# EAGLE design OLIMEXINO-32U4_rev_A3 (EAGLE 6.4)
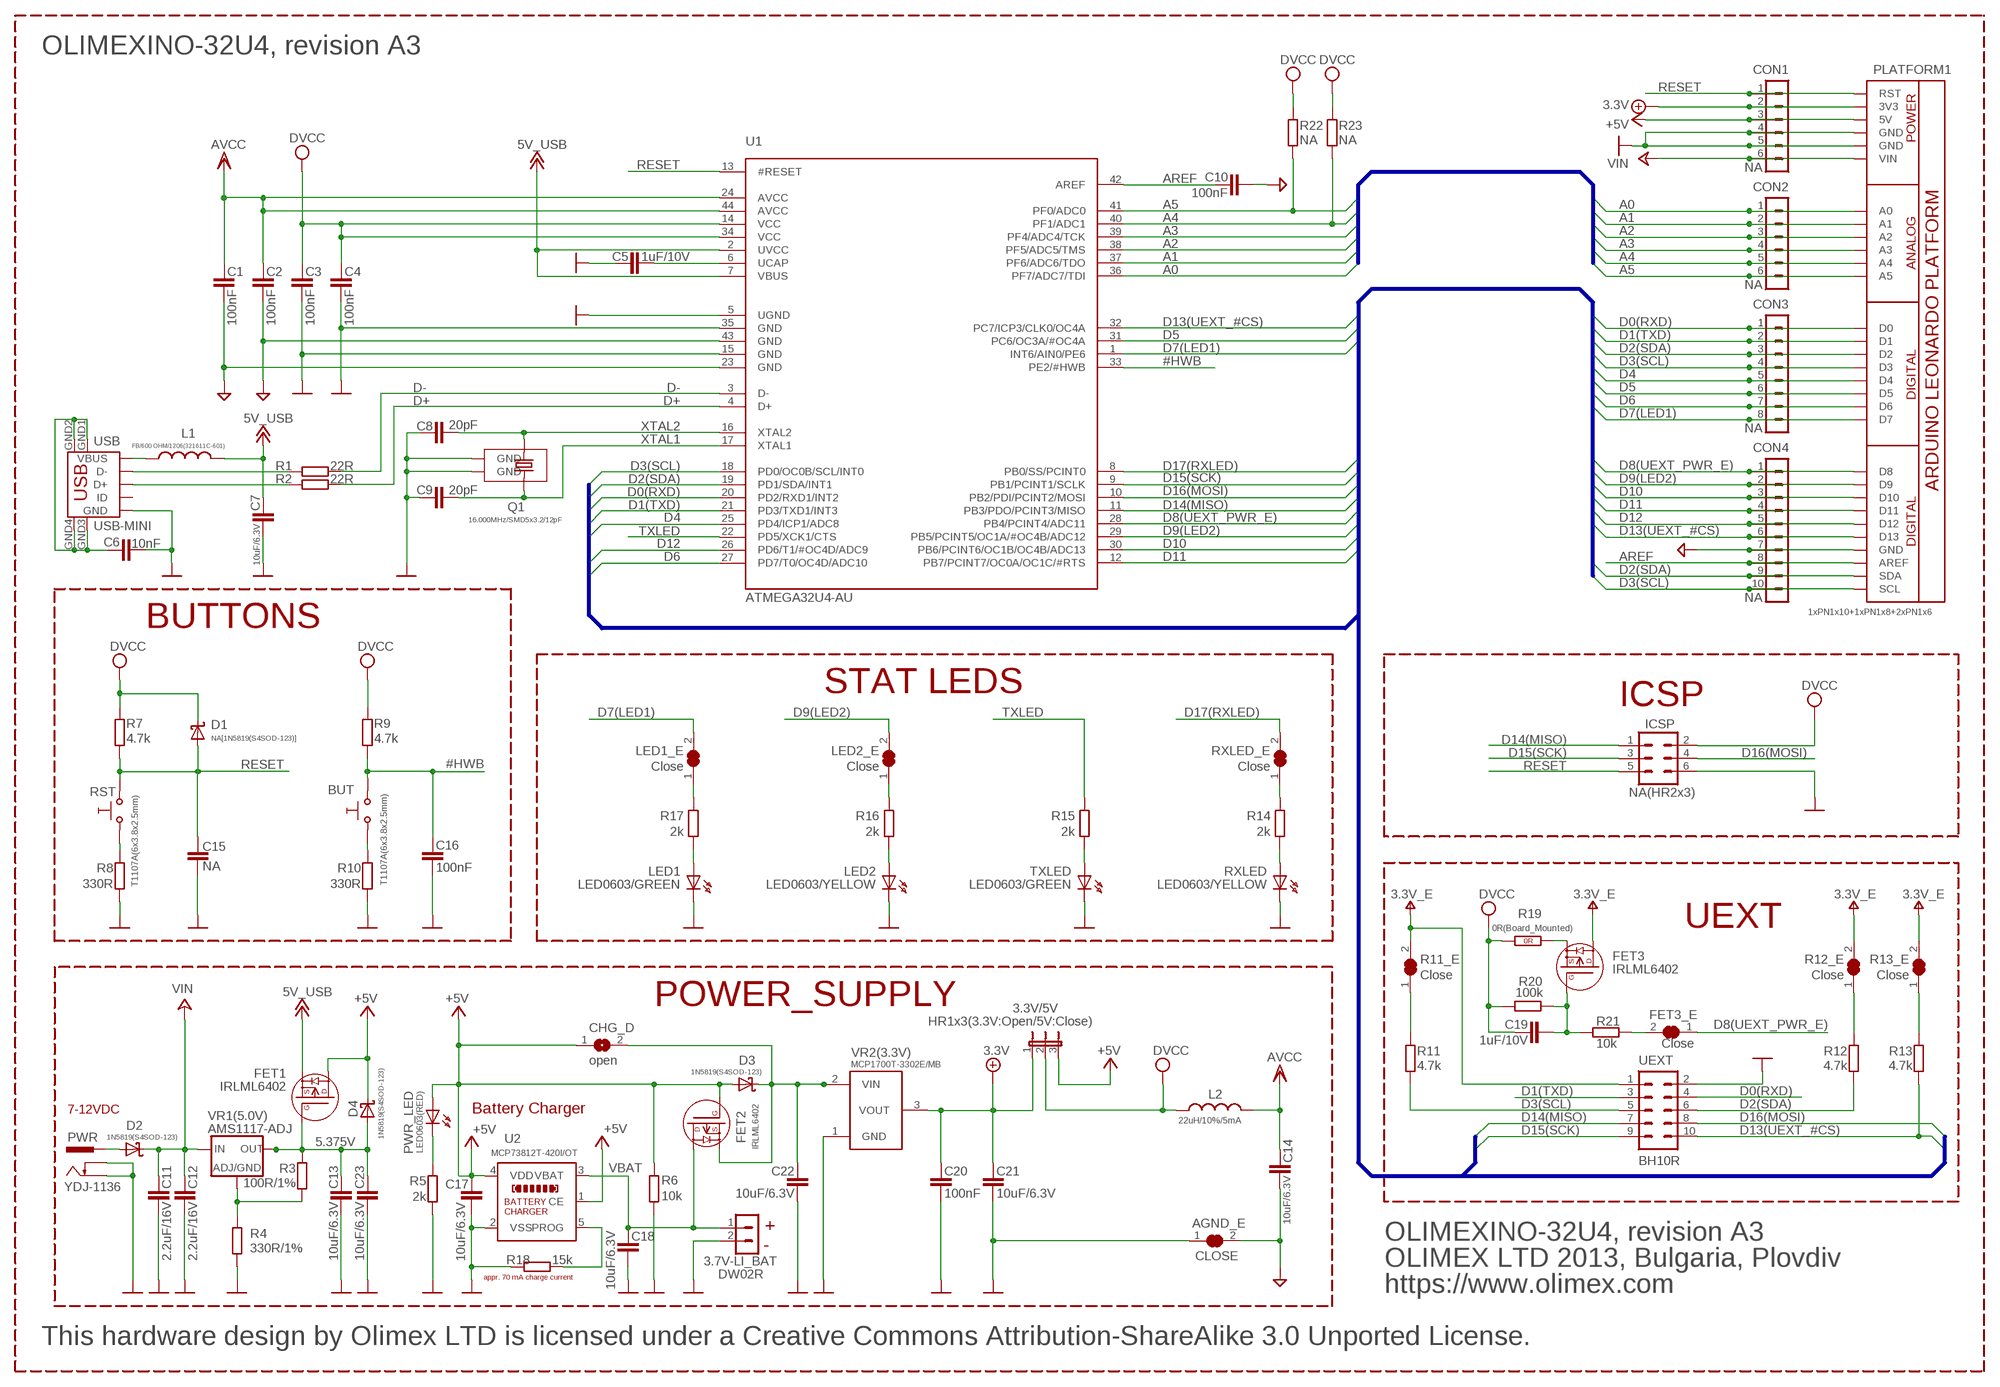
[diagram p0: schematic, sheet 1]

## Parts
3.3V/5V  HR1x3(3.3V:Open/5V:Close)  JP2EHR1X3  [HR1X3]
3.7V-LI_BAT  DW02R  CON2DW02R  [DW02R]
AGND_E  CLOSE  SJSJ_1_SMALLER_CLOSE  [SJ_1_SMALLER_CLOSE]
BUT  T1107A(6x3.8x2.5mm)  SW-TAKT6  [SW-TAKT_6X3.5_SMD]
C1  100nF  C-EUC0603_DWS  [C0603_DWS]
C2  100nF  C-EUC0603_DWS  [C0603_DWS]
C3  100nF  C-EUC0603_DWS  [C0603_DWS]
C4  100nF  C-EUC0603_DWS  [C0603_DWS]
C5  1uF/10V  C-EUC0603_DWS  [C0603_DWS]
C6  10nF  C-EUC0603_DWS  [C0603_DWS]
C7  10uF/6.3V  C-EUC0603_DWS  [C0603_DWS]
C8  20pF  C-EUC0603_DWS  [C0603_DWS]
C9  20pF  C-EUC0603_DWS  [C0603_DWS]
C10  100nF  C-EUC0603_DWS  [C0603_DWS]
C11  2.2uF/16V  C-EUC0805_5MIL_DWS  [C0805_5MIL_DWS]
C12  2.2uF/16V  C-EUC0805_5MIL_DWS  [C0805_5MIL_DWS]
C13  10uF/6.3V  C-EUC0603_DWS  [C0603_DWS]
C14  10uF/6.3V  C-EUC0603_DWS  [C0603_DWS]
C15  NA  C-EUC0603_DWS  [C0603_DWS]
C16  100nF  C-EUC0603_DWS  [C0603_DWS]
C17  10uF/6.3V  C-EUC0603_DWS  [C0603_DWS]
C18  10uF/6.3V  C-EUC0603_DWS  [C0603_DWS]
C19  1uF/10V  C-EUC0603_DWS  [C0603_DWS]
C20  100nF  C-EUC0603_DWS  [C0603_DWS]
C21  10uF/6.3V  C-EUC0603_DWS  [C0603_DWS]
C22  10uF/6.3V  C-EUC0603_DWS  [C0603_DWS]
C23  10uF/6.3V  C-EUC0603_DWS  [C0603_DWS]
CHG_D  open  SJSJ_SMALLER  [SJ_1_SMALLER]
CON1  NA  CON6HN1X6  [HN1X6]
CON2  NA  CON6HN1X6  [HN1X6]
CON3  NA  CON8HN1X8  [HN1X8]
CON4  NA  CON10HN1X10  [HN1X10]
D1  NA[1N5819(S4SOD-123)]  SCHOTKKY7.62SS-1N5819(S4SOD-123)  [SOD-123]
D2  1N5819(S4SOD-123)  SCHOTKKY7.62SS-1N5819(S4SOD-123)  [SOD-123]
D3  1N5819(S4SOD-123)  SCHOTKKY7.62SS-1N5819(S4SOD-123)  [SOD-123]
D4  1N5819(S4SOD-123)  SCHOTKKY7.62SS-1N5819(S4SOD-123)  [SOD-123]
FET1  IRLML6402  P-MOS+DIODIRLML6402  [SOT23]
FET2  IRLML6402  P-MOS+DIODIRLML6402  [SOT23]
FET3  IRLML6402  P-MOS+DIODIRLML6402  [SOT23]
FET3_E  Close  SJSJ_1_SMALLER_CLOSE  [SJ_1_SMALLER_CLOSE]
ICSP  NA(HR2x3)  ML6HN2X3R  [HN2X3R]
L1  FB/600 OHM/1206(321611C-601)  L-USL3216C  [L3216C]
L2  22uH/10%/5mA  L-USL3216C  [L3216C]
LED1  LED0603/GREEN  LED0603DWS  [LED-0603]
LED1_E  Close  SJSJ_1_SMALLER_CLOSE  [SJ_1_SMALLER_CLOSE]
LED2  LED0603/YELLOW  LED0603DWS  [LED-0603]
LED2_E  Close  SJSJ_1_SMALLER_CLOSE  [SJ_1_SMALLER_CLOSE]
PLATFORM1  1xPN1x10+1xPN1x8+2xPN1x6  ARDUINO_LEONARDO  [ARDUINO-LEONARDO-PLATFORM]
PWR  YDJ-1136  PWR-JAKPWR_JACK_UNI_MILLING  [PWR_JACK_UNI_MILLING]
PWR_LED  LED0603(RED)  LED0603DWS  [LED-0603]
Q1  16.000MHz/SMD5x3.2/12pF  SMALL_SMD_CRYSTAL  [CRYSTAL_SMD]
R1  22R  R-EU_R0603_5MIL_DWS  [R0603_5MIL_DWS]
R2  22R  R-EU_R0603_5MIL_DWS  [R0603_5MIL_DWS]
R3  100R/1%  R-EU_R0603_5MIL_DWS  [R0603_5MIL_DWS]
R4  330R/1%  R-EU_R0603_5MIL_DWS  [R0603_5MIL_DWS]
R5  2k  R-EU_R0603_5MIL_DWS  [R0603_5MIL_DWS]
R6  10k  R-EU_R0603_5MIL_DWS  [R0603_5MIL_DWS]
R7  4.7k  R-EU_R0603_5MIL_DWS  [R0603_5MIL_DWS]
R8  330R  R-EU_R0603_5MIL_DWS  [R0603_5MIL_DWS]
R9  4.7k  R-EU_R0603_5MIL_DWS  [R0603_5MIL_DWS]
R10  330R  R-EU_R0603_5MIL_DWS  [R0603_5MIL_DWS]
R11  4.7k  R-EU_R0603_5MIL_DWS  [R0603_5MIL_DWS]
R11_E  Close  SJSJ_1_SMALLER_CLOSE  [SJ_1_SMALLER_CLOSE]
R12  4.7k  R-EU_R0603_5MIL_DWS  [R0603_5MIL_DWS]
R12_E  Close  SJSJ_1_SMALLER_CLOSE  [SJ_1_SMALLER_CLOSE]
R13  4.7k  R-EU_R0603_5MIL_DWS  [R0603_5MIL_DWS]
R13_E  Close  SJSJ_1_SMALLER_CLOSE  [SJ_1_SMALLER_CLOSE]
R14  2k  R-EU_R0603_5MIL_DWS  [R0603_5MIL_DWS]
R15  2k  R-EU_R0603_5MIL_DWS  [R0603_5MIL_DWS]
R16  2k  R-EU_R0603_5MIL_DWS  [R0603_5MIL_DWS]
R17  2k  R-EU_R0603_5MIL_DWS  [R0603_5MIL_DWS]
R18  15k  R-EU_R0603_5MIL_DWS  [R0603_5MIL_DWS]
R19  0R(Board_Mounted)  R_0R0R(NA)  [0603_0R]
R20  100k  R-EU_R0603_5MIL_DWS  [R0603_5MIL_DWS]
R21  10k  R-EU_R0603_5MIL_DWS  [R0603_5MIL_DWS]
R22  NA  R-EU_R0603_5MIL_DWS  [R0603_5MIL_DWS]
R23  NA  R-EU_R0603_5MIL_DWS  [R0603_5MIL_DWS]
RST  T1107A(6x3.8x2.5mm)  SW-TAKT6  [SW-TAKT_6X3.5_SMD]
RXLED  LED0603/YELLOW  LED0603DWS  [LED-0603]
RXLED_E  Close  SJSJ_1_SMALLER_CLOSE  [SJ_1_SMALLER_CLOSE]
TXLED  LED0603/GREEN  LED0603DWS  [LED-0603]
U1  ATMEGA32U4-AU  ATMEGA32U4U  [TQFP44]
U2  MCP73812T-420I/OT  MCP7381XSOT-23-5  [SOT-23-5]
UEXT  BH10R  ML10R  [BH10R]
USB  USB-MINI  MINI_USB9  [USB_MINI_9PIN]
VR1(5.0V)  AMS1117-ADJ  LM1117  [SOT223]
VR2(3.3V)  MCP1700T-3302E/MB  MCP1700-REP1  [SOT89_REP_THERMALOFF]

## Nets
3.3V_REG_IN: C22.1 CHG_D.2 D3.C FET2.2(S) VR2(3.3V).2(VIN) VR2(3.3V).P$2(VIN1)
5.375V: C13.1 C23.1 D4.A FET1.1(G) R3.2 VR1(5.0V).2(OUT) VR1(5.0V).4(RAD)
#HWB: BUT.P$2 C16.1 R9.2 U1.33(PE2/#HWB)
+5V: 3.3V/5V.3 C17.1 CHG_D.1 CON1.3 D3.A D4.C FET1.3(D) FET2.1(G) PLATFORM1.5V PWR_LED.A R6.1 U2.1(CE) U2.4(VDD)
+5V/1: 3.3V/5V.1 C20.1 C21.1 CON1.2 PLATFORM1.3V3 VR2(3.3V).3(VOUT) ; supply symbol labelled 3.3V
+12V: C7.1 FET1.2(S) L1.2 U1.2(UVCC) U1.7(VBUS) ; supply symbol labelled 5V_USB
+24V: C11.1 C12.1 CON1.6 D2.C PLATFORM1.VIN VR1(5.0V).3(IN) ; supply symbol labelled VIN
A0: CON2.1 PLATFORM1.A0 U1.36(PF7/ADC7/TDI)
A1: CON2.2 PLATFORM1.A1 U1.37(PF6/ADC6/TDO)
A2: CON2.3 PLATFORM1.A2 U1.38(PF5/ADC5/TMS)
A3: CON2.4 PLATFORM1.A3 U1.39(PF4/ADC4/TCK)
A4: CON2.5 PLATFORM1.A4 R23.1 U1.40(PF1/ADC1)
A5: CON2.6 PLATFORM1.A5 R22.1 U1.41(PF0/ADC0)
AGND: AGND_E.2 C1.2 C2.2 C10.2 C14.2 CON4.7 PLATFORM1.GND@2(GND) U1.23(GND) U1.43(GND)
AREF: C10.1 CON4.8 PLATFORM1.AREF U1.42(AREF)
D0(RXD): CON3.1 PLATFORM1.D0 U1.20(PD2/RXD1/INT2) UEXT.4
D1(TXD): CON3.2 PLATFORM1.D1 U1.21(PD3/TXD1/INT3) UEXT.3
D2(SDA): CON3.3 CON4.9 PLATFORM1.D2 PLATFORM1.SDA R12.1 U1.19(PD1/SDA/INT1) UEXT.6
D3(SCL): CON3.4 CON4.10 PLATFORM1.D3 PLATFORM1.SCL R11.1 U1.18(PD0/OC0B/SCL/INT0) UEXT.5
D4: CON3.5 PLATFORM1.D4 U1.25(PD4/ICP1/ADC8)
D5: CON3.6 PLATFORM1.D5 U1.31(PC6/OC3A/#OC4A)
D6: CON3.7 PLATFORM1.D6 U1.27(PD7/T0/OC4D/ADC10)
D7(LED1): CON3.8 LED1_E.2 PLATFORM1.D7 U1.1(INT6/AIN0/PE6)
D8(UEXT_PWR_E): CON4.1 FET3_E.1 PLATFORM1.D8 U1.28(PB4/PCINT4/ADC11)
D9(LED2): CON4.2 LED2_E.2 PLATFORM1.D9 U1.29(PB5/PCINT5/OC1A/#OC4B/ADC12)
D10: CON4.3 PLATFORM1.D10 U1.30(PB6/PCINT6/OC1B/OC4B/ADC13)
D11: CON4.4 PLATFORM1.D11 U1.12(PB7/PCINT7/OC0A/OC1C/#RTS)
D12: CON4.5 PLATFORM1.D12 U1.26(PD6/T1/#OC4D/ADC9)
D13(UEXT_#CS): CON4.6 PLATFORM1.D13 R13.1 U1.32(PC7/ICP3/CLK0/OC4A) UEXT.10
D14(MISO): ICSP.1 U1.11(PB3/PDO/PCINT3/MISO) UEXT.7
D15(SCK): ICSP.3 U1.9(PB1/PCINT1/SCLK) UEXT.9
D16(MOSI): ICSP.4 U1.10(PB2/PDI/PCINT2/MOSI) UEXT.8
D17(RXLED): RXLED_E.2 U1.8(PB0/SS/PCINT0)
D+: R2.2 U1.4(D+)
D-: R1.2 U1.3(D-)
GND [pwr]: 3.7V-LI_BAT.2 AGND_E.1 C3.2 C4.2 C5.1 C6.2 C7.2 C8.1 C9.1 C11.2 C12.2 C13.2 C15.2 C16.2 C17.2 C18.2 C20.2 C21.2 C22.2 C23.2 CON1.4 CON1.5 ICSP.6 LED1.C LED2.C PLATFORM1.GND PLATFORM1.GND@1(GND) PWR.- PWR.-- Q1.NC_1(GND) Q1.NC_2(GND) R4.1 R5.2 R6.2 R8.1 R10.1 R18.1 RXLED.C TXLED.C U1.5(UGND) U1.15(GND) U1.35(GND) U2.2(VSS) UEXT.2 USB.GND VR2(3.3V).1(GND)
N$1: R1.1 USB.D-
N$2: R14.2 RXLED_E.1
N$3: R2.1 USB.D+
N$4: R11.2 R11_E.1
N$5: R15.1 TXLED.A
N$6: FET3_E.2 R21.2
N$8: R13.2 R13_E.1
N$9: LED1.A R17.1
N$11 [pwr]: R8.2 RST.P$2
N$12: BUT.P$1 R10.2
N$13: R12.2 R12_E.1
N$15: LED1_E.1 R17.2
N$16: D2.A PWR.+
N$17: LED2.A R16.1
N$18: LED2_E.1 R16.2
N$19: C19.2 FET3.1(G) R20.2 R21.1
N$20: FET3.2(S) R19.2(1.2)
N$21: PWR_LED.C R5.1
N$22: R18.2 U2.5(PROG)
N$23: R14.1 RXLED.A
N$118: C6.1 USB.GND1 USB.GND2 USB.GND3 USB.GND4
RESET: C15.1 CON1.1 D1.A ICSP.5 PLATFORM1.RST R7.2 RST.P$1 U1.13(#RESET)
TXLED: R15.2 U1.22(PD5/XCK1/CTS)
UCAP: C5.2 U1.6(UCAP)
V+: FET3.3(D) R11_E.2 R12_E.2 R13_E.2 UEXT.1 ; supply symbol labelled 3.3V_E
VBAT: 3.7V-LI_BAT.1 C18.1 FET2.3(D) U2.3(VBAT)
VBUS: L1.1 USB.VBUS
VCC: 3.3V/5V.2 C3.1 C4.1 C19.1 D1.C ICSP.2 L2.1 R7.1 R9.1 R19.1(1.1) R20.1 R22.2 R23.2 U1.14(VCC) U1.34(VCC) ; supply symbol labelled DVCC
VDD: C1.1 C2.1 C14.1 L2.2 U1.24(AVCC) U1.44(AVCC) ; supply symbol labelled AVCC
VR1_ADJ: R3.1 R4.2 VR1(5.0V).1(ADJ/GND)
XTAL1: C9.2 Q1.1 U1.17(XTAL1)
XTAL2: C8.2 Q1.2 U1.16(XTAL2)
Unconnected: USB.ID

## Buses
A[0..5]
D0(RXD),D1(TXD),D2(SDA),D3(SCL),D[4..6],D7(LED1),D8(UEXT_PWR_E),D9(LED2),D[10..12],D13(UEXT_#CS),D14(RXLED),D15(SCK),D16(MOSI),D17(MISO)

## Notes on the sheet
- OLIMEXINO-32U4, revision A3
- BUTTONS
- STAT LEDS
- ICSP
- UEXT
- POWER_SUPPLY
- 7-12VDC | Battery Charger
- +
- - | OLIMEXINO-32U4, revision A3
- OLIMEX LTD 2013, Bulgaria, Plovdiv
- appr. 70 mA charge current
- https://www.olimex.com
- This hardware design by Olimex LTD is licensed under a Creative Commons Attribution-ShareAlike 3.0 Unported License.

## Library data of the parts
3.3V/5V = jumper:JP2E: JUMPER
3.7V-LI_BAT = Penko:CON2
AGND_E CHG_D FET3_E LED1_E LED2_E R11_E R12_E R13_E RXLED_E = jumper:SJ: SMD solder JUMPER
BUT RST = gogo:SW-TAKT
C1-C23 = rcl:C-EU: CAPACITOR, European symbol
CON1 CON2 = Penko:CON6: CONNECTORS - 6 PINS
CON3 = Penko:CON8
CON4 = Penko:CON10
D1-D4 = gogo:SCHOTKKY7.62SS
FET1-FET3 = Penko:P-MOS+DIOD
ICSP = con-harting-ml:ML6: HARTING
L1 L2 = rcl:L-US: INDUCTOR, American symbol
LED1 LED2 PWR_LED RXLED TXLED = DOUBLE-SIDE:LED
PLATFORM1 = OLIMEX_CASES:ARDUINO_LEONARDO
PWR = gogo:PWR-JAK
Q1 = OLIMEX_DISCRET:SMALL_SMD_CRYSTAL
R1-R18 R20-R23 = rcl:R-EU_: RESISTOR, European symbol
R19 = OLIMEX_DISCRET:R_0R
U1 = OLIMEX_IC:ATMEGA32U4: 8-bit Microcontroller with 16/32K Bytes of ISP Flash and USB Controller
U2 = OLIMEX_DISCRET:MCP7381X
UEXT = con-harting-ml:ML10: HARTING
USB = OLIMEX_CONNECTORS:MINI_USB9
VR1(5.0V) = arm:LM1117
VR2(3.3V) = OLIMEX_DISCRET:MCP1700-REP

## Net classes
1 pwr: width 0.25 mm

## Board
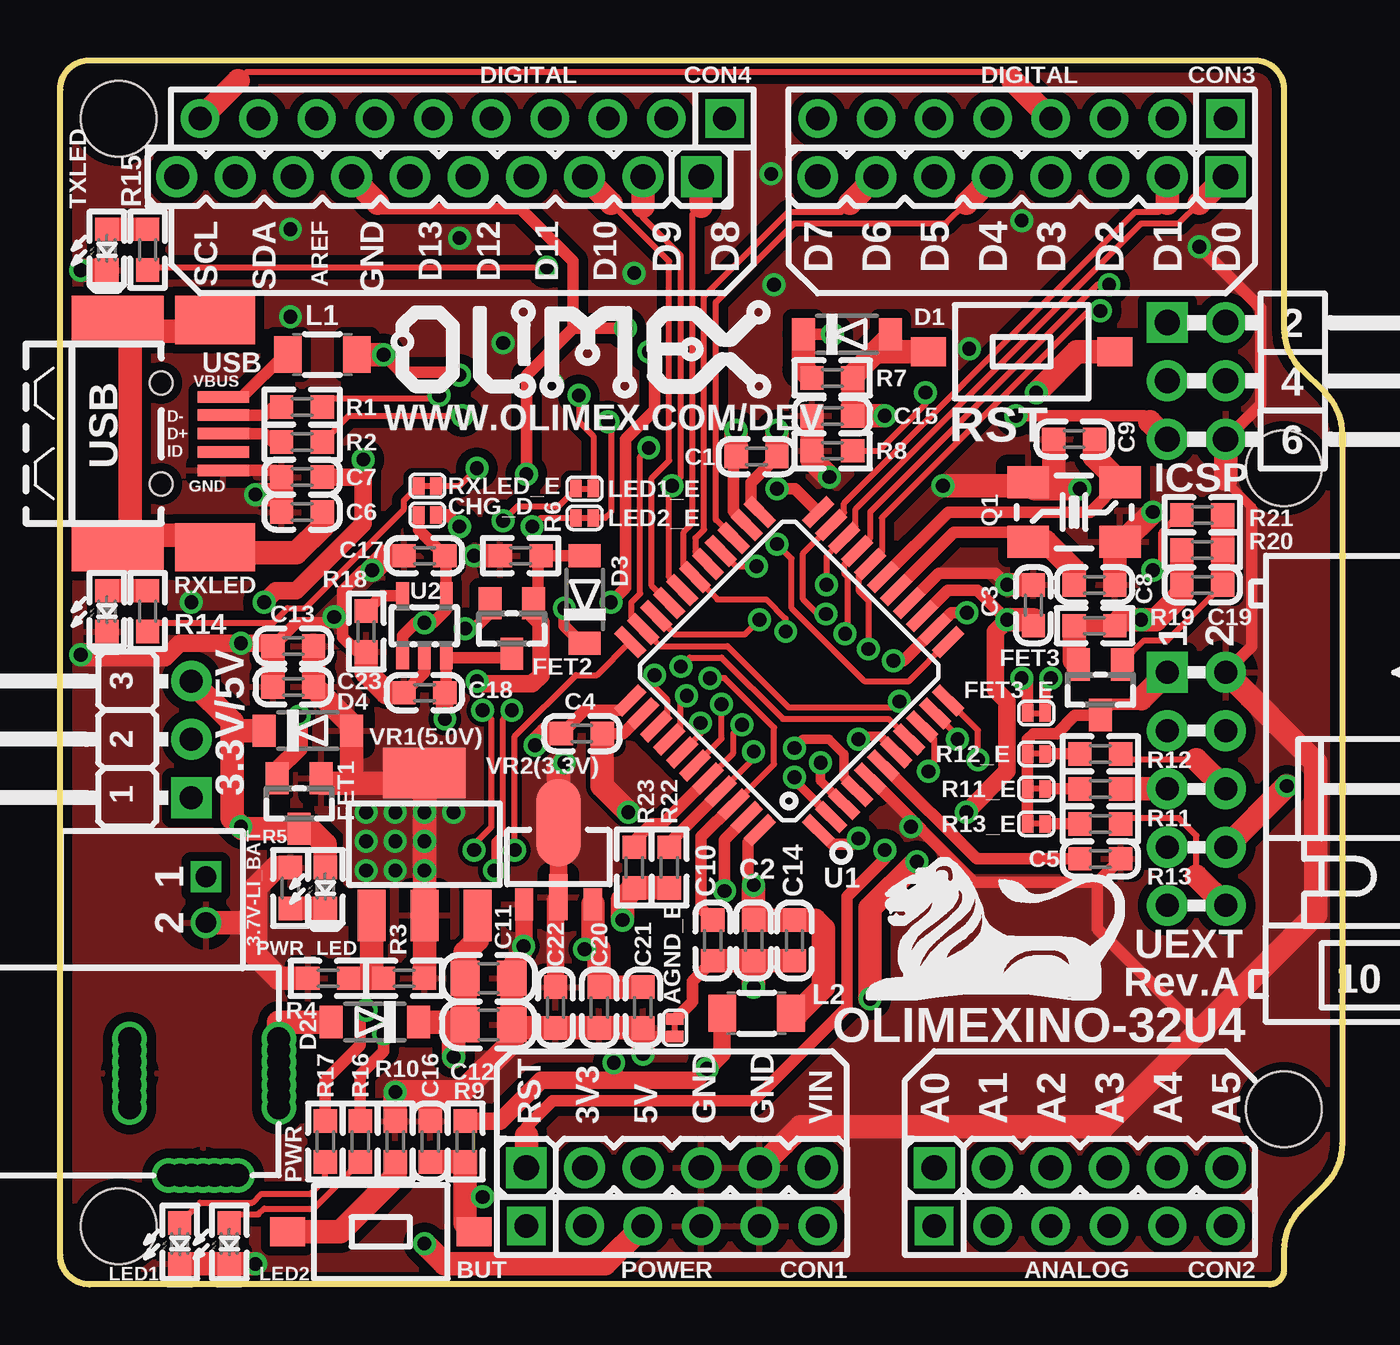
[diagram p1: board, top side]
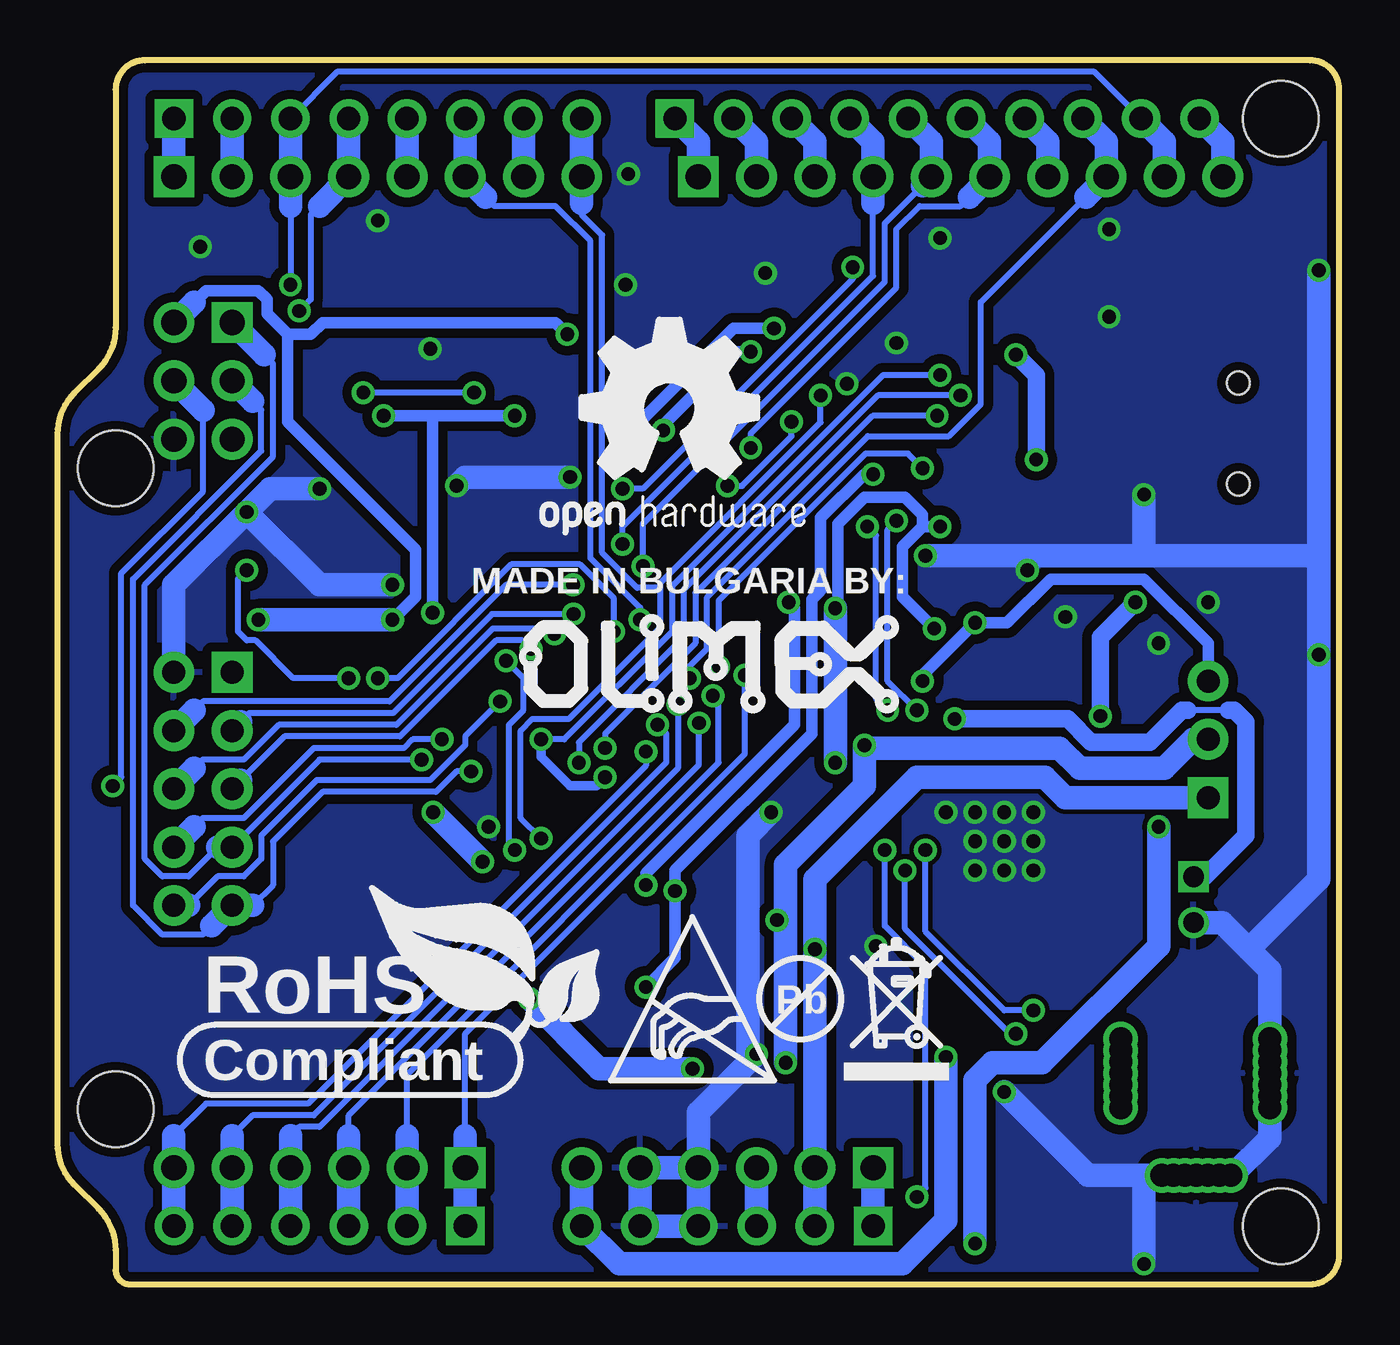
[diagram p2: board, bottom side, seen from below]

Size 55.88 x 53.34 mm. Coordinates in mm from the lower left corner, seen from the top.
Copper layers (1+16): Top 0.035mm / dielectric 1.5mm / Bottom 0.035mm
Design rules "default": minimum track width 10mil, minimum drill 0.6mm, track to track 0.2mm, track to pad 0.2mm, pad to pad 0.2mm, via to via 0.2mm, smd to smd 1mil, copper to edge 10mil, drill to drill 8mil, minimum pad ring 8mil, minimum via ring 0.2mm, stop-mask expansion 4mil, vias tented up to drill 25mil, thermal gap 20mil

### Footprints (pad centres in the part's own frame; a part is rotated, then mirrored left to right if it is on the bottom)
HR1X3 = drill 1 pad 1.778 square: 1 -2.54,0 | drill 1 pad 1.778: 2 0,0; 3 2.54,0
DW02R = drill 0.9 square: 1 -1,0 | drill 0.9: 2 1,0
SJ_1_SMALLER_CLOSE = smd 0.508 x 0.762: 1 -0.381,0; 2 0.381,0
SW-TAKT_6X3.5_SMD = smd 1.27 x 1.524: P$1 0,4.064; P$2 0,-4.064
C0603_DWS = smd 1.016 x 1.016: 1 -0.889,0; 2 0.889,0
C0805_5MIL_DWS = smd 1.27 x 1.524: 1 -1.016,0; 2 1.016,0
SJ_1_SMALLER = smd 0.508 x 0.762: 1 -0.381,0; 2 0.381,0
HN1X6 = drill 1.1 pad 1.778 square: 1 -6.35,0 | drill 1.1 pad 1.778: 2 -3.81,0; 3 -1.27,0; 4 1.27,0; 5 3.81,0; 6 6.35,0
HN1X8 = drill 1.1 pad 1.778 square: 1 -8.89,0 | drill 1.1 pad 1.778: 2 -6.35,0; 3 -3.81,0; 4 -1.27,0; 5 1.27,0; 6 3.81,0; 7 6.35,0; 8 8.89,0
HN1X10 = drill 1.1 pad 1.778 square: 1 -11.43,0 | drill 1.1 pad 1.778: 2 -8.89,0; 3 -6.35,0; 4 -3.81,0; 5 -1.27,0; 6 1.27,0; 7 3.81,0; 8 6.35,0; 9 8.89,0; 10 11.43,0
SOD-123 = smd 1 x 1.4: A 1.9,0; C -1.9,0
SOT23 = smd 1 x 1.4: 1 -0.95,-1.1; 2 0.95,-1.1; 3 0,1.1
HN2X3R = drill 1.1 pad 1.778 square: 1 -2.54,-1.27 | drill 1.1 pad 1.778: 2 -2.54,1.27; 3 0,-1.27; 4 0,1.27; 5 2.54,-1.27; 6 2.54,1.27
L3216C = smd 1.2 x 1.6: 1 -1.5,0; 2 1.5,0
LED-0603 = smd 1.016 x 1.016: A 0.889,0; C -0.889,0
ARDUINO-LEONARDO-PLATFORM = drill 1.016 pad 1.676: 3V3 22.86,2.54; 5V 25.4,2.54; A1 40.64,2.54; A2 43.18,2.54; A3 45.72,2.54; A4 48.26,2.54; A5 50.8,2.54; AREF 11.176,50.8; D1 48.26,50.8; D2 45.72,50.8; D3 43.18,50.8; D4 40.64,50.8; D5 38.1,50.8; D6 35.56,50.8; D7 33.02,50.8; D9 26.416,50.8; D10 23.876,50.8; D11 21.336,50.8; D12 18.796,50.8; D13 16.256,50.8; GND 27.94,2.54; GND@1 30.48,2.54; GND@2 13.716,50.8; SCL 6.096,50.8; SDA 8.636,50.8; VIN 33.02,2.54 | drill 1.016 pad 1.676 square: A0 38.1,2.54; D0 50.8,50.8; D8 28.956,50.8; RST 20.32,2.54 | hole 3.3: 53.34,35.56; 53.34,7.62; 2.54,50.8; 2.54,2.54
PWR_JACK_UNI_MILLING = drill 1: + 0,4.75; +1 0,5.25; +2 0,5.75; +3 0,6.25; +4 0,4.25; +5 0,3.75; +6 0,3.25; - -6.5,4.75; -1 -6.5,5.25; -2 -6.5,5.75; -3 -6.5,4.25; -4 -6.5,3.75; -5 -6.5,6.25; -6 -6.5,3.25; -- -3.3,0.3; --1 -3.8,0.3; --2 -4.3,0.3; --3 -4.8,0.3; --4 -2.8,0.3; --5 -2.3,0.3; --6 -1.8,0.3
CRYSTAL_SMD = smd 1.8 x 1.4: 1 -2,-1.3; 2 2,1.3; NC_1 2,-1.3; NC_2 -2,1.3
R0603_5MIL_DWS = smd 1.016 x 1.016: 1 -0.889,0; 2 0.889,0
0603_0R = smd 1.016 x 1.016: 1 -0.889,0; 2 0.889,0
TQFP44 = smd 1.5 x 0.5: 1 -5.78,3.95; 2 -5.78,3.15; 3 -5.78,2.35; 4 -5.78,1.55; 5 -5.78,0.75; 6 -5.78,-0.05; 7 -5.78,-0.85; 8 -5.78,-1.65; 9 -5.78,-2.45; 10 -5.78,-3.25; 11 -5.78,-4.05; 23 5.82,-4.05; 24 5.82,-3.25; 25 5.82,-2.45; 26 5.82,-1.65; 27 5.82,-0.85; 28 5.82,-0.05; 29 5.82,0.75; 30 5.82,1.55; 31 5.82,2.35; 32 5.82,3.15; 33 5.82,3.95 | smd 0.5 x 1.5: 12 -3.98,-5.85; 13 -3.18,-5.85; 14 -2.38,-5.85; 15 -1.58,-5.85; 16 -0.78,-5.85; 17 0.02,-5.85; 18 0.82,-5.85; 19 1.62,-5.85; 20 2.42,-5.85; 21 3.22,-5.85; 22 4.02,-5.85; 34 4.02,5.75; 35 3.22,5.75; 36 2.42,5.75; 37 1.62,5.75; 38 0.82,5.75; 39 0.02,5.75; 40 -0.78,5.75; 41 -1.58,5.75; 42 -2.38,5.75; 43 -3.18,5.75; 44 -3.98,5.75
SOT-23-5 = smd 0.55 x 1.2: 1 -0.95,-1.3; 2 0,-1.3; 3 0.95,-1.3; 4 0.95,1.3; 5 -0.95,1.3
BH10R = drill 1 pad 1.778 square: 1 -5.08,-1.27 | drill 1 pad 1.778: 2 -5.08,1.27; 3 -2.54,-1.27; 4 -2.54,1.27; 5 0,-1.27; 6 0,1.27; 7 2.54,-1.27; 8 2.54,1.27; 9 5.08,-1.27; 10 5.08,1.27
USB_MINI_9PIN = smd 2.25 x 0.5: D+ 2.706,0; D- 2.706,0.8; GND 2.706,-1.6; ID 2.706,-0.8; VBUS 2.706,1.6 | smd 4 x 2.1: GND1 -1.9,4.95; GND3 -1.9,-4.95 | smd 3.5 x 2.1: GND2 2.35,4.95; GND4 2.35,-4.95 | hole 1: 0,2.2; 0,-2.2
SOT223 = smd 1.219 x 2.235: 1 -2.311,-3.099; 2 0,-3.099; 3 2.311,-3.099 | smd 3.6 x 2.2: 4 0,3.099
SOT89_REP_THERMALOFF = smd 0.8 x 1.4: 1 -1.499,-1.981; 3 1.499,-1.981 | smd 0.8 x 2: 2 0,-1.681 | smd 1.93 x 3.81: P$2 0,1.57

### Placement (x,y rotation side)
3.3V/5V  5.71,23.75 90 top
3.7V-LI_BAT  6.35,16.76 270 top
AGND_E  26.8,11.18 90 top
BUT  13.97,2.29 90 top
C1  30.35,36.07 0 top
C2  30.23,14.99 270 top
C3  42.42,29.59 90 top
C4  22.73,24 0 top
C5  45.34,18.54 180 top
C6  10.54,33.66 180 top
C7  10.54,35.18 180 top
C8  45.09,30.48 180 top
C9  44.2,36.83 0 top
C10  28.45,14.99 270 top
C11  18.67,13.34 0 top
C12  18.67,11.3 0 top
C13  10.16,27.81 180 top
C14  32,14.99 270 top
C15  33.66,37.85 180 top
C16  16.13,6.22 90 top
C17  15.88,31.75 180 top
C18  15.88,25.78 180 top
C19  49.78,30.48 0 top
C20  23.5,12.06 270 top
C21  25.4,12.06 270 top
C22  21.59,12.06 270 top
C23  10.16,26.04 180 top
CHG_D  16,33.53 0 top
CON1  26.67,5.08 0 top
CON2  44.45,5.08 0 top
CON3  41.91,48.26 180 top
CON4  16.51,48.26 180 top
D1  34.29,41.4 0 top
D2  13.72,11.43 180 top
D3  22.86,29.84 90 top
D4  10.79,24.13 0 top
FET1  10.41,20.95 180 top
FET2  19.68,28.57 180 top
FET3  45.34,25.91 180 top
FET3_E  42.55,24.89 0 top
ICSP  49.53,39.37 270 top
L1  11.43,40.51 0 top
L2  30.35,11.81 0 top
LED1  5.21,1.78 90 top
LED1_E  22.86,34.67 0 top
LED2  7.37,1.78 90 top
LED2_E  22.86,33.4 0 top
PLATFORM1  0,0 0 top
PWR  9.53,4.45 0 top
PWR_LED  11.56,17.27 90 top
Q1  44.2,33.66 180 top
R1  10.54,38.23 0 top
R2  10.54,36.7 0 top
R3  14.99,13.34 0 top
R4  11.68,13.34 0 top
R5  10.03,17.27 90 top
R6  20.07,31.75 180 top
R7  33.66,39.5 0 top
R8  33.66,36.32 0 top
R9  17.65,6.22 270 top
R10  14.61,6.22 270 top
R11  45.34,21.59 180 top
R11_E  42.55,21.59 180 top
R12  45.34,23.11 180 top
R12_E  42.55,23.11 180 top
R13  45.34,20.07 180 top
R13_E  42.55,20.07 180 top
R14  3.81,29.34 270 top
R15  3.81,45.09 270 top
R16  13.08,6.22 90 top
R17  11.56,6.22 90 top
R18  13.34,28.45 90 top
R19  45.09,28.7 180 top
R20  49.78,32 0 top
R21  49.78,33.53 180 top
R22  26.54,18.16 270 top
R23  25.02,18.16 270 top
RST  41.91,40.64 90 top
RXLED  2.03,29.34 90 top
RXLED_E  16,34.8 0 top
TXLED  2.03,45.09 90 top
U1  31.75,26.67 135 top
U2  15.88,28.7 0 top
U$1  [RECYCLE_BIN1/8]  21.59,8.89 0 bottom
U$2  [PB_SMALL]  23.5,12.45 0 bottom
U$3  [LOGO-OPENHARDWARE_8X8]  29.21,38.1 0 bottom
U$8  [ROHS]  49.53,8.89 0 bottom
U$9  [OLIMEX1_V]  32.13,38.48 0 top
U$10  [LION_12X7MM]  40.39,13.97 0 top
U$11  [ESD_SYMBOL]  31.75,8.89 0 bottom
U$12  [OLIMEX1_V]  18.03,24.77 0 bottom
UEXT  49.53,21.59 270 top
USB  4.4,37.07 0 top
VR1(5.0V)  15.88,19.18 0 top
VR2(3.3V)  21.72,18.54 0 top

### Tracks (layer width: path | path; a pad name or v marks a point on that pad's centre or on a via)
3.3V_REG_IN  (via drill 0.6)
  Top 0.508: v17.4,33.02 16.89,33.53 CHG_D.2 | FET2.2 18.73,29.28 18.03,28.57 v17.65,28.57 | D3.C 22.73,27.95 21.97,28.7 v21.97,29.46
  Top 0.762: VR2(3.3V).P$2 VR2(3.3V).2 21.59,16.73 C22.1
  Top 1.016: VR2(3.3V).P$2 21.72,22.48 v21.97,22.73
  Bottom 0.508: 18.16,33.02 19.05,32.13 19.05,29.97 v17.65,28.57 | 18.16,33.02 v17.4,33.02 | v21.97,29.46 21.84,29.59 21.84,33.15 20.7,34.29 18.92,34.29 18.16,33.53 18.16,33.02
  Bottom 1.016: v21.97,22.73 v21.97,29.46
  pour Top: 19.68,17.53 20.45,17.53 20.7,17.27 20.7,12.19 20.83,12.06 22.35,12.06 22.61,12.32 22.61,17.4 22.86,17.65 24.26,17.65 24.38,17.78 24.38,22.48 22.99,23.88 20.95,23.88 19.56,22.48 19.56,17.53
5.375V  (via drill 0.6)
  Top 1.016: C13.1 C23.1 12.7,24.38 D4.A 12.7,21.84 | 15.88,21.84 v15.88,20.57 v15.88,19.3 v15.88,18.03 VR1(5.0V).2 R3.2 | 15.88,21.84 VR1(5.0V).4 | 15.88,21.84 12.7,21.84 | FET1.1 11.36,21.84 12.7,21.84
  other vias: 17.14,20.57 14.61,20.57 14.61,19.3 13.34,19.3 13.34,20.57 14.61,18.03 13.34,18.03
  pour Top: 10.16,28.45 10.16,25.27 10.92,24.64 10.92,23.11 10.16,22.35 10.16,20.57 10.41,20.32 11.81,20.32 12.45,19.68 12.45,17.53 12.57,17.4 13.08,17.4 13.34,17.14 13.34,13.08 13.84,12.57 16.64,12.57 17.65,13.59 17.65,17.14 17.91,17.4 18.67,17.4 19.05,17.78 19.05,24.51 17.91,25.65 13.97,25.65 12.95,26.67 12.95,27.94 12.06,28.83 10.54,28.83
  pour Bottom: 14.99,12.06 18.92,16 18.92,22.73 13.21,22.73 12.06,21.59 9.02,21.59 7.87,20.45 7.87,14.61 10.41,12.06
#HWB  (via drill 0.6)
  Top 0.254: 17.65,3.81 v18.41,3.81 | U1.33 23.39,26.54 22.48,26.54 19.81,23.88 v19.81,18.92
  Top 1.016: C16.1 R9.2 17.65,3.81 17.65,2.67 BUT.P$2
  Bottom 0.254: v18.41,3.81 18.03,4.19 18.03,13.84 19.81,15.62 v19.81,18.92
+5V  (via drill 0.6)
  Top 0.508: U2.1 14.93,28.26 15.49,28.83 v15.88,28.83 16.26,28.83 16.82,29.4 U2.4 16.82,31.69 C17.1 15.62,32.89 CHG_D.1 | FET2.1 20.83,29.68 20.83,31.5 21.08,31.75 | D3.A 21.08,31.75 | 21.08,31.75 R6.1
  Top 0.762: 7.49,24.51 7.49,24.26 7.49,24.13 | FET2.1 20.64,29.15 20.95,28.83 20.95,26.54 20.57,26.16 18.29,26.16 v18.16,26.29
  Top 1.016: 7.49,24.13 D4.C | 7.49,24.51 3.3V/5V.3 | PLATFORM1.5V 23.75,0.89 16.76,0.89 v15.88,1.78 | 7.49,24.26 7.49,20.32 v7.87,19.94 7.96,19.86 FET1.3 10.88,19.86 11.56,19.18 PWR_LED.A
  Bottom 0.508: 3.3V/5V.3 5.71,27.94 8.51,30.73 12.57,30.73 14.48,28.83 v15.88,28.83 18.16,26.54 v18.16,26.29
  Bottom 1.016: PLATFORM1.5V CON1.3 | v15.88,1.78 15.88,8.89 15.11,9.65 12.95,9.65 7.87,14.73 v7.87,19.94
+5V/1  (via drill 0.6)
  Top 1.016: C21.1 C20.1 23.5,14.61 23.22,14.61 | 23.22,14.61 VR2(3.3V).3 | v22.86,14.61 23.22,14.61
  Bottom 1.016: PLATFORM1.3V3 CON1.2 v22.86,14.61 22.86,17.65 18.41,22.1 12.83,22.1 11.94,21.21 3.3V/5V.1
+12V  (via drill 0.6)
  Top 0.406: U1.7 35.75,23.88 34.92,23.88 v34.8,23.75 | U1.2 32,21.96 v32,22.1
  Top 0.508: v14.1,40.51 14.86,39.75 17.27,39.75 v17.4,39.62
  Top 0.762: 13.21,35.18 13.21,33.15 10.29,30.23 9.4,30.23 v8.89,29.72 | 13.21,35.18 v13.21,35.94 | 13.21,35.18 C7.1 | FET1.2 9.46,22.42 10.41,23.37 v10.41,24.77
  Top 1.016: v14.1,40.51 L1.2
  Bottom 0.254: v34.8,23.75 33.78,23.75 29.08,28.45 29.08,30.43 19.89,39.62 v17.4,39.62
  Bottom 0.406: v32,22.1 32.38,21.72 33.53,21.72 34.8,22.99 v34.8,23.75
  Bottom 0.762: v14.1,40.51 13.21,39.62 v13.21,35.94 | v10.41,24.77 10.41,28.19 v8.89,29.72
+24V  (via drill 0.6)
  Top 1.016: 17.65,11.43 C11.1 17.65,14.48 18.19,15.01 VR1(5.0V).3 | 17.14,11.43 17.65,11.43 | 17.65,11.43 C12.1 | v17.14,9.91 17.14,11.43 | 17.14,11.43 D2.C
  Bottom 1.016: CON1.6 PLATFORM1.VIN 31.37,0.89 19.05,0.89 17.14,2.79 v17.14,9.91
A0  (via drill 0.6)
  Top 0.254: U1.36 26.44,24.78 26.44,25.5 25.91,26.04 v25.91,26.54
  Bottom 0.254: v25.91,26.54 25.91,23.11 38.1,10.92 38.1,6.48
  Bottom 1.016: PLATFORM1.A0 CON2.1 38.1,6.48
A1  (via drill 0.6)
  Top 0.254: U1.37 27.03,24.24 27.03,25.38 v27.3,25.65
  Bottom 0.254: v27.3,25.65 27.05,25.4 27.05,22.73 40.64,9.14 40.64,6.48
  Bottom 1.016: PLATFORM1.A1 CON2.2 40.64,6.48
A2  (via drill 0.6)
  Top 0.254: U1.38 27.91,23.99 v27.91,24.46
  Bottom 0.254: v27.91,24.46 27.91,22.63 43.18,7.37 43.18,6.48
  Bottom 1.016: PLATFORM1.A2 CON2.3 43.18,6.48
A3  (via drill 0.6)
  Top 0.254: U1.39 28.83,23.78 v28.83,25.27
  Bottom 0.254: v28.83,25.27 28.83,22.48 44.45,6.86 45.34,6.86 45.72,6.48
  Bottom 1.016: PLATFORM1.A3 CON2.4 45.72,6.48
A4  (via drill 0.6)
  Top 0.254: U1.40 29.34,23.15 29.34,24 v29.72,24.38
  Top 0.508: U1.40 26.25,20.07 25.78,20.07 25.02,19.3 R23.1
  Bottom 0.254: v29.72,24.38 29.34,24 29.34,22.73 44.7,7.37 47.37,7.37 48.26,6.48
  Bottom 1.016: PLATFORM1.A4 CON2.5 48.26,6.48
A5  (via drill 0.6)
  Top 0.254: U1.41 30.23,22.91 v30.23,23.22
  Top 0.508: U1.41 26.54,19.23 R22.1
  Bottom 0.254: v30.23,23.22 30.23,22.61 44.96,7.87 49.4,7.87 50.8,6.48
  Bottom 1.016: PLATFORM1.A5 CON2.6 50.8,6.48
AGND  (via drill 0.6)
  Top 0.508: AGND_E.2 27.56,12.32 27.56,13.21 C10.2 | U1.43 28.96,19.38 v28.96,17.14 | U1.23 30.1,34.05 30.1,34.92 C1.2 | 13.84,47.12 14.1,46.86 20.07,46.86 22.35,44.58 22.35,41.66 | v20.32,35.31 20.32,39.62 22.35,41.66 | 22.35,41.66 v24.64,41.66
  Top 1.016: C10.2 C2.2 | C2.2 C14.2 | C2.2 v30.23,12.95 | v31.24,37.21 C1.2 | 13.84,47.12 CON4.7
  Bottom 0.508: v30.23,12.95 28.96,14.22 v28.96,17.14 28.96,18.03 22.99,24 22.99,29.84 22.61,30.23 22.61,33.4 20.7,35.31 v20.32,35.31 | v24.64,41.66 26.42,41.66 30.86,37.21 v31.24,37.21
  Bottom 1.016: PLATFORM1.GND@2 12.7,49.78 CON4.7
AREF  (via drill 0.6)
  Top 0.254: U1.42 31.11,22.67 31.11,24.26 28.96,26.42 v28.32,26.42
  Top 0.508: C10.1 27.94,16.38 27.94,19.49 U1.42
  Bottom 0.254: v28.32,26.42 28.32,26.92 27.56,27.69 27.56,29.95 20.55,36.96 17.02,36.96 15.62,38.35 15.62,42.8 11.05,47.37
  Bottom 1.016: PLATFORM1.AREF 10.16,49.78 CON4.8 11.05,47.37
D0(RXD)  (via drill 0.6)
  Top 0.254: 49.66,47.12 48.77,46.23 47.12,46.23 34.67,33.78 34.67,33.01 U1.20 33.4,31.74 v33.4,30.48
  Top 1.016: 49.66,47.12 CON3.1
  Bottom 0.254: v33.4,30.48 36.32,30.48 41.4,25.4 49.53,25.4 49.91,25.02
  Bottom 1.016: CON3.1 PLATFORM1.D0 | 49.91,25.02 UEXT.4
D1(TXD)  (via drill 0.6)
  Top 0.254: v33.38,29.21 33.02,29.21 32.38,29.84 32.38,31.86 U1.21 34.16,33.64 34.16,34.04 46.86,46.74 47.88,46.74 48.26,47.12
  Top 1.016: 48.26,47.12 CON3.2
  Bottom 0.254: v33.38,29.21 36.93,29.21 41.25,24.89 47.5,24.89 47.88,24.51
  Bottom 1.016: CON3.2 PLATFORM1.D1 | 47.88,24.51 UEXT.3
D2(SDA)  (via drill 0.6)
  Top 0.254: R12.1 46.48,22.86 49.53,22.86 | v34.21,28.35 34.31,28.45 34.31,30.84 34.16,30.99 34.16,31.37 U1.19 35.31,32.52 35.31,33.66 45.21,43.56 v45.72,43.56
  Top 1.016: UEXT.6 49.53,22.86
  Bottom 0.254: PLATFORM1.SDA 10.67,52.83 43.69,52.83 PLATFORM1.D2 | v34.21,28.35 34.44,28.57 36.91,28.57 41.1,24.38 46.23,24.38 47.75,22.86 49.53,22.86 49.91,22.48 | 45.72,46.99 v45.72,43.56
  Bottom 1.016: CON4.9 7.62,49.78 PLATFORM1.SDA | PLATFORM1.D2 CON3.3 45.72,46.99 | 49.91,22.48 UEXT.6
D3(SCL)  (via drill 0.6)
  Top 0.254: 7.75,52.45 8.13,52.83 41.15,52.83 41.53,52.45 | v35.23,27.69 35.23,29.79 34.8,30.23 34.8,30.88 U1.18 35.81,31.89 35.81,33.4 44.83,42.42 v45.34,42.42
  Top 1.016: PLATFORM1.SCL 7.75,52.45 | 41.53,52.45 PLATFORM1.D3 | UEXT.5 R11.1
  Bottom 0.254: v35.23,27.69 35.61,28.07 36.75,28.07 40.95,23.88 45.97,23.88 47.88,21.97 | 44.45,46.99 44.83,46.61 44.83,42.93 v45.34,42.42
  Bottom 1.016: CON4.10 5.08,49.78 PLATFORM1.SCL | PLATFORM1.D3 CON3.4 44.45,46.99 | 47.88,21.97 UEXT.5
D4
  Top 0.254: U1.25 28.57,33.31 28.57,42.8 32,46.23 38.61,46.23 39.5,47.12
  Top 1.016: 39.5,47.12 CON3.5
  Bottom 1.016: CON3.5 PLATFORM1.D4
D5  (via drill 0.6)
  Top 0.254: U1.31 26.78,28.32 29.84,28.32 v30.48,28.96
  Bottom 0.254: v30.48,28.96 30.48,29.49 32.64,31.65 32.64,45.47 34.16,46.99 36.83,46.99 37.21,47.37
  Bottom 1.016: PLATFORM1.D5 CON3.6 37.21,47.37
D6
  Top 0.254: U1.27 27.69,31.94 27.69,32.51 28.07,32.89 28.07,43.05 31.75,46.74 34.04,46.74 34.42,47.12
  Top 1.016: 34.42,47.12 CON3.7
  Bottom 1.016: CON3.7 PLATFORM1.D6
D7(LED1)  (via drill 0.6)
  Top 0.254: v22.61,38.73 22.61,37.59 23.24,36.96 LED1_E.2
  Top 0.508: U1.1 33.66,19.18 34.54,19.18 v34.8,19.43
  Bottom 0.254: v34.8,19.43 35.69,20.32 35.69,24.13 35.18,24.64 33.58,24.64 29.59,28.63 29.59,30.35 | 29.59,30.35 30.61,30.35 32.13,31.88 32.13,45.72 33.02,46.61 33.02,47.12 | 29.59,30.35 29.59,30.58 22.61,37.57 v22.61,38.73
  Bottom 1.016: PLATFORM1.D7 CON3.8 33.02,47.12
D8(UEXT_PWR_E)  (via drill 0.6)
  Top 0.254: 27.94,46.99 27.56,46.61 27.56,33.15 27.18,32.77 27.18,31.31 U1.28 28.65,29.84 30.79,29.84 31.62,29.01 v31.62,28.45
  Top 0.508: v41.91,26.42 42.16,26.16 FET3_E.1
  Top 1.016: 27.94,46.99 CON4.1
  Bottom 0.254: v31.62,28.45 31.62,29.9 33.1,31.37 36.09,31.37 41.05,26.42 v41.91,26.42
  Bottom 1.016: PLATFORM1.D8 27.94,49.78 CON4.1
D9(LED2)  (via drill 0.6)
  Top 0.254: U1.29 26.54,30.82 26.54,34.67 v26.67,34.8 27.05,35.18 27.05,44.83 25.4,46.48 25.4,46.99 | v23.88,37.59 24,37.47 24,33.66 23.75,33.4 LED2_E.2
  Top 1.016: 25.4,46.99 CON4.2
  Bottom 0.254: v26.67,34.8 26.04,34.8 23.88,36.96 v23.88,37.59
  Bottom 1.016: PLATFORM1.D9 25.4,49.78 CON4.2
D10
  Top 0.254: U1.30 25.78,30.45 25.78,35.13 26.54,35.89 26.54,44.58 24,47.12
  Top 1.016: 24,47.12 CON4.3
  Bottom 1.016: PLATFORM1.D10 22.86,49.78 CON4.3
D11  (via drill 0.6)
  Top 0.254: U1.12 37,26.29 35.05,26.29 31.88,29.46 31.88,31.62 v31.24,32.26
  Bottom 0.254: v31.24,32.26 31.24,33.02 20.32,43.94 20.32,47.12
  Bottom 1.016: PLATFORM1.D11 20.32,49.78 CON4.4 20.32,47.12
D12  (via drill 0.6)
  Top 0.254: U1.26 29.46,31.29 v30.35,31.29
  Bottom 0.254: v30.35,31.29 30.35,33.15 19.81,43.69 19.81,46.23 18.16,47.88
  Bottom 1.016: PLATFORM1.D12 17.78,49.78 CON4.5 18.16,47.88
D13(UEXT_#CS)  (via drill 0.6)
  Top 0.254: R13.1 46.48,20.32 48.77,20.32 49.53,19.56 49.53,17.78 | v25.65,36.45 25.27,36.07 25.27,30.1 24.89,29.72 24.89,29.07 U1.32 26.15,27.81 29.08,27.81 31.75,25.15 36.32,25.15 v36.58,25.4
  Top 1.016: UEXT.10 49.53,17.78
  Bottom 0.254: v25.65,36.45 25.65,37.08 19.3,43.43 19.3,45.97 18.29,46.99 16.51,46.99 16.13,47.37 | v36.58,25.4 38.1,23.88 38.1,23.5 39.62,21.97 44.58,21.97 46.99,19.56 46.99,18.54 47.75,17.78 48.9,17.78 50.16,16.51
  Bottom 1.016: PLATFORM1.D13 15.24,49.78 CON4.6 16.13,47.37 | 50.16,16.51 UEXT.10
D14(MISO)  (via drill 0.6)
  Top 0.254: U1.11 40.01,24.14 v40.01,22.86
  Bottom 0.254: v40.01,22.86 44.45,22.86 UEXT.7 | 46.86,40.51 46.48,40.13 46.48,36.07 52.07,30.48 52.07,18.54 51.31,17.78 50.16,17.78 48.9,19.05
  Bottom 1.016: 46.86,40.51 ICSP.1 | UEXT.7 48.9,19.05
D15(SCK)  (via drill 0.6)
  Top 0.254: U1.9 38.1,23.79 38.1,22.61 v37.85,22.35
  Bottom 0.254: v37.85,22.35 38.48,22.35 39.37,21.46 44.32,21.46 46.48,19.3 46.48,17.4 47.37,16.51 | 47.37,38.48 46.99,38.1 46.99,36.32 52.58,30.73 52.58,16.51 51.31,15.24 49.53,15.24 49.15,15.62
  Bottom 1.016: 47.37,16.51 UEXT.9 49.15,15.62 | 47.37,38.48 ICSP.3
D16(MOSI)  (via drill 0.6)
  Top 0.254: U1.10 39.12,23.9 v39.12,23.75
  Top 1.016: UEXT.8 v53.47,21.72
  Bottom 0.254: v39.12,23.75 40.39,23.75 40.77,23.37 44.7,23.37 47.75,20.32 49.53,20.32 49.91,19.94 | 49.53,38.1 49.53,34.54 53.09,30.99 53.09,22.1 v53.47,21.72
  Bottom 1.016: 49.91,19.94 UEXT.8 | 49.53,38.1 ICSP.4
D17(RXLED)  (via drill 0.6)
  Top 0.254: U1.8 36.12,24.64 31.5,24.64 28.83,27.3 27.43,27.3 v27.05,26.92 | RXLED_E.2 17.4,34.8 v18.16,35.56
  Bottom 0.254: v27.05,26.92 27.05,29.79 20.65,36.2 18.8,36.2 v18.16,35.56
D+  (via drill 0.6)
  Top 0.254: R2.2 12.57,37.85 v17.53,37.85
  Top 0.406: U1.4 34.16,22.07 34.16,23.09 33.5,23.75 32.38,23.75 v32,23.37
  Bottom 0.254: v32,23.37 32,24 28.07,27.94 28.07,30.12 20.34,37.85 v17.53,37.85
D-  (via drill 0.6)
  Top 0.254: R1.2 11.81,38.61 16.38,38.61 v16.51,38.73
  Top 0.406: U1.3 33.15,21.95 v33.15,22.73
  Bottom 0.254: v33.15,22.73 33.15,23.62 28.57,28.19 28.57,30.28 20.12,38.73 v16.51,38.73
GND  (via drill 0.6)
  Top 0.406: 51.94,33.78 51.94,33.86 50.8,35 50.8,35.08
  Top 0.508: USB.GND 9.36,35.47 C7.2 | C18.2 15.88,26.67 U2.2 | R18.1 12.95,27.56 12.32,28.19 12.32,28.83 | 12.32,28.83 10.29,28.83 C13.2 | 25.4,10.79 AGND_E.1 | 12.32,28.83 12.32,30.23 13.21,31.11 v13.59,31.11 | U1.15 38.3,30.99 40.77,30.99 v41.27,30.48 | 51.94,33.78 51.94,27.81 UEXT.2 | U1.5 39.83,17.53 45.21,17.53 | U1.35 24.53,24 C4.2 | 45.21,17.53 45.21,15.49 49.66,11.05 | 45.21,17.53 C5.1 | ICSP.6 52.32,38.35 52.32,42.55 v49.66,45.21
  Top 0.762: VR2(3.3V).1 20.22,14.5 19.68,13.97 C11.2 | 2.03,27.43 2.03,27.3 4.57,27.3 5.21,27.94 v7.87,27.94 9.14,27.94 C13.2
  Top 1.016: v0.89,44.2 TXLED.C | C13.2 C23.2 | C11.2 C12.2 19.68,11.18 | 19.68,11.18 C22.2 C20.2 C21.2 25.4,10.79 v25.4,10.03 | R18.1 13.34,26.67 14.22,25.78 C18.2 | 16.13,8.38 C16.2 | 16.13,8.38 17.53,8.38 19.68,10.54 19.68,11.18 | R10.1 v14.61,8.38 16.13,8.38 | v8.51,0.89 LED2.C LED1.C | 9.65,34.42 C7.2 | v8.51,34.42 9.65,34.42 | v13.59,31.11 14.22,31.75 C17.2 | R5.2 9.4,18.16 8.51,17.27 8.51,15.75 | 8.51,15.75 8.51,14.35 9.53,13.34 R4.1 | 3.7V-LI_BAT.2 6.37,15.75 8.51,15.75 | v0.89,27.43 2.03,27.43 RXLED.C | 9.65,34.42 C6.2 | v18.03,31.75 R6.2 | C15.2 R8.1 32.77,35.94 v33.53,35.18 | C8.1 45.97,32.13 Q1.NC_2 46.33,32.35 v47.62,33.66 | v41.27,30.48 C3.2 | v44.45,34.67 43.31,34.67 | 43.31,34.67 42.48,34.67 Q1.NC_1 42.04,34.8 v38.48,34.8 | 43.31,34.67 C9.1 | v24.77,20.57 23.62,21.72 C4.2 | CON1.5 32.26,6.86 45.47,6.86 49.66,11.05 54.74,16.13 54.74,22.73 UEXT.2 | 50.8,35.08 ICSP.6
  Bottom 1.016: CON1.4 PLATFORM1.GND PLATFORM1.GND@1 CON1.5 CON1.4 | 0.89,31.75 v0.89,27.43 0.89,17.65 3.94,14.61 | 0.89,31.75 v0.89,44.2 | 3.7V-LI_BAT.2 5.1,15.76 3.94,14.61 | 3.94,14.61 3.02,13.69 PWR.- 3.02,6.37 4.65,4.75 PWR.-- 8.51,4.75 | 8.51,4.75 10.97,4.75 v14.61,8.38 | v8.51,0.89 8.51,4.75 | 8.51,31.75 v8.51,34.42 | 0.89,31.75 8.51,31.75 | 8.51,31.75 13.59,31.75 | CON1.4 27.94,7.49 v25.4,10.03 25.78,10.03 25.78,19.56 v24.77,20.57 | 13.59,31.75 v18.03,31.75 | 13.59,31.75 v13.59,31.11 | v47.62,33.66 50.8,30.48 UEXT.2 | v44.45,34.67 46.61,34.67 v47.62,33.66 | v41.27,30.48 44.45,30.48 v47.62,33.66 | v33.53,35.18 38.1,35.18 v38.48,34.8
  other vias: 10.03,45.97 10.03,42.16 17.4,45.59 19.3,41.02 21.46,39.24 37.08,19.94 5.71,29.72 11.94,29.08 39.62,40.77 31.11,43.56 41.91,46.35 25.02,44.07 30.99,48.39 20.19,14.73
  pour Top (isolate 0.406, rank 2): -2.54,55.88 58.42,55.88 58.42,-2.54 -2.54,-2.54
  pour Bottom (isolate 0.406, rank 2): -5.08,58.42 60.96,58.42 60.96,-5.08 -5.08,-5.08
N$1
  Top 0.508: USB.D- 8.92,37.87 9.27,38.23 R1.1 9.78,38.23
N$2
  Top 0.254: R14.2 4.19,28.83 9.27,28.83 9.91,29.46 10.67,29.46 14.99,33.78 14.99,34.16 RXLED_E.1
N$3
  Top 0.508: USB.D+ 8.9,37.07 9.27,36.7 R2.1
N$4
  Top 0.508: R11_E.1 R11.2
N$5
  Top 1.016: TXLED.A R15.1
N$6  (via drill 0.6)
  Top 0.254: v47.62,31.11 48.01,31.5 48.01,32.77 48.77,33.53 R21.2
  Top 0.508: v43.18,26.42 42.93,26.16 FET3_E.2
  Bottom 0.254: v47.62,31.11 48.01,30.73 48.01,28.45 47.62,28.07 47.24,28.07 45.59,26.42 v43.18,26.42
N$8
  Top 0.508: R13_E.1 R13.2
N$9
  Top 0.254: LED1.A 6.1,3.56 8.38,3.56 8.76,3.94 10.92,3.94 11.56,4.57 R17.1
N$11  (via drill 0.6)
  Top 0.254: R8.2 35.69,36.32 37.72,38.35 v37.72,38.86
  Top 1.016: RST.P$2 44.32,40.64 v42.55,38.86
  Bottom 0.254: v37.72,38.86 v42.55,38.86
N$12
  Top 1.016: R10.2 14.61,4.7 12.19,2.29 BUT.P$1
N$13
  Top 0.508: R12_E.1 R12.2
N$15  (via drill 0.6)
  Top 0.254: LED1_E.1 21.72,33.91 19.94,33.91 v19.3,33.27 | v18.03,18.92 18.03,19.18 18.8,19.94 18.8,24.64 v18.41,25.02
  Top 0.508: R17.2 11.56,8.89 13.08,10.41 13.08,11.68 v13.34,11.94
  Bottom 0.254: v13.34,11.94 14.61,11.94 18.03,15.37 v18.03,18.92 | v19.3,33.27 19.68,32.89 19.68,26.29 v18.41,25.02
N$16
  Top 1.016: PWR.+ 9.53,11.43 D2.A
N$17
  Top 0.254: LED2.A 7.75,3.05 8.64,3.05 8.89,3.3 11.05,3.3 R16.1
N$18  (via drill 0.6)
  Top 0.254: LED2_E.1 20.95,33.4 v20.57,33.02 | v18.92,18.03 18.92,19.3 19.3,19.68 19.3,24.64 v19.68,25.02
  Top 0.508: R16.2 13.08,9.14 14.1,10.16 v14.1,10.92
  Bottom 0.254: v14.1,10.92 14.35,10.92 18.92,15.49 v18.92,18.03 | v20.57,33.02 20.19,32.64 20.19,25.53 v19.68,25.02
N$19
  Top 0.254: FET3.1 46.29,27.11 47.24,28.07 48.26,28.07 C19.2
  Top 1.016: C19.2 R20.2 R21.1
N$20
  Top 1.016: FET3.2 44.2,27.2 R19.2
N$21
  Top 1.016: R5.1 PWR_LED.C
N$22
  Top 0.508: U2.5 14,30 R18.2
N$23
  Top 1.016: RXLED.A R14.1
N$118
  Top 1.016: USB.GND3 2.5,32.64 3.05,32.64 | USB.GND1 2.5,41.66 3.05,41.66 3.05,41.53 | 3.05,32.64 3.05,41.53 | USB.GND2 6.75,41.53 3.05,41.53 | 3.05,32.64 6.75,32.64 USB.GND4 6.75,31.88 10.29,31.88 11.43,33.02 C6.1
RESET  (via drill 0.6)
  Top 0.508: v39.52,29.26 38.84,29.26 U1.13 36.76,27.18 v36.32,27.18 | v41.66,37.85 47.24,37.85 47.5,37.59 | v35.94,18.92 35.94,18.54 34.29,16.89 34.29,12.06 30.23,8 21.46,8 20.32,6.86 20.32,6.48
  Top 1.016: D1.A 36.19,41.27 35.56,40.64 | 35.56,40.64 34.54,39.62 R7.2 C15.1 v35.94,37.85 | 35.56,40.64 RST.P$1 | 47.5,37.59 ICSP.5 | CON1.1 20.32,6.48
  Bottom 0.254: v36.32,27.18 35.56,26.42 35.56,25.02 36.2,24.38 36.2,19.18 v35.94,18.92
  Bottom 0.508: 39.52,37.85 v35.94,37.85 | 39.52,37.85 v41.66,37.85 | v39.52,29.26 39.52,37.85
  Bottom 1.016: PLATFORM1.RST CON1.1
TXLED  (via drill 0.6)
  Top 0.254: R15.2 3.94,44.32 v21.21,44.32
  Top 0.508: U1.22 32.02,34.67 v31.24,34.67
  Bottom 0.254: v31.24,34.67 30.35,34.67 21.21,43.81 v21.21,44.32
UCAP
  Top 0.508: U1.6 39.95,18.54 C5.2
V+
  Top 0.508: R13_E.2 R11_E.2 R12_E.2 42.16,23.75 42.42,24 43.43,24 44.24,24.81 FET3.3 45.8,25.27 46.86,25.27 47.12,25.53
  Top 1.016: 47.12,25.53 UEXT.1
VBAT  (via drill 0.6)
  Top 0.508: C18.1 16.82,25.84 U2.3 16.92,27.3 19.52,27.3 FET2.3
  Top 0.762: v16.76,24.64 C18.1
  Bottom 0.254: 4.83,25.02 6.6,25.02
  Bottom 0.762: 3.7V-LI_BAT.1 5.86,17.76 4.06,19.56 4.06,24.51 4.57,25.02 4.83,25.02 | 6.6,25.02 6.86,25.02 8.26,23.62 10.82,23.62 11.84,24.64 v16.76,24.64
VBUS
  Top 0.508: USB.VBUS 7.94,38.67 9.78,40.51 L1.1
VCC  (via drill 0.6)
  Top 0.508: U1.14 38.7,30.25 39.98,30.25 v41.27,28.96 | D1.C v33.66,41.4 | U1.34 24.41,25.02 22.86,25.02 C4.1
  Top 0.762: R9.1 19.18,7.11 20.95,8.89 24.13,8.89 | 24.13,8.89 v24.13,9.65 | 24.13,8.89 27.69,8.89 v28.19,9.4 28.85,10.06 L2.1 | v39.5,20.57 41.27,22.35 41.27,25.4 40.77,25.91 40.77,28.45 v41.27,28.96
  Top 1.016: R22.2 R23.2 24.51,16.76 v24.51,15.88 | D1.C 32.39,39.87 R7.1 | R20.1 C19.1 48.9,30.1 47.75,28.96 v47.12,28.96 46.23,28.96 R19.1 | C3.1 42.42,28.96 v41.27,28.96 | v20.7,23.5 21.21,24 C4.1 | v35.31,12.45 35.31,16.38 v37.34,18.41
  Bottom 0.508: 49.91,42.8 49.4,43.31 47.12,43.31 46.74,42.93 46.74,42.29 45.85,41.4 | v41.27,28.96 40.26,29.97 40.26,32 45.85,37.59 45.85,41.4 | 45.85,41.4 44.83,41.4 44.32,41.91 34.16,41.91 v33.66,41.4
  Bottom 1.016: v41.27,28.96 v47.12,28.96 | 49.91,42.8 ICSP.2 | 3.3V/5V.2 6.35,23.75 7.62,22.48 11.3,22.48 12.19,23.37 20.7,23.37 | 20.7,23.37 v20.7,23.5 | 20.7,23.37 20.7,21.72 24.13,18.29 24.13,15.88 | v24.13,9.65 24.13,15.88 | 24.13,15.88 v24.51,15.88 | v28.19,9.4 32.26,9.4 v35.31,12.45 | v37.34,18.41 v39.5,20.57
VDD  (via drill 0.6)
  Top 0.508: U1.44 29.97,19.26 29.97,17.65 v30.23,17.4 | U1.24 29.34,33.68 29.34,35.94 C1.1 | v24,29.72 24.64,30.35 24.64,36.83 25.91,38.1 25.91,40.39 v25.65,40.64
  Top 1.016: L2.2 32.13,11.81 33.27,12.95 33.27,15.49 32.89,15.88 C14.1 C2.1 v30.23,17.4 | v29.46,37.21 C1.1
  Bottom 0.508: v30.23,17.4 30.23,17.91 23.75,24.38 23.75,29.46 v24,29.72 | v25.65,40.64 26.29,40.64 29.46,37.47 v29.46,37.21
VR1_ADJ
  Top 1.016: 13.56,13.34 R3.1 | 13.56,13.34 VR1(5.0V).1 | R4.2 13.56,13.34
XTAL1
  Top 0.508: U1.17 38.71,33.66 44.9,33.66 Q1.1
  Top 1.016: Q1.1 45.09,36.07 C9.2
XTAL2
  Top 0.508: U1.16 38.95,32.77 41.78,32.77 Q1.2
  Top 1.016: Q1.2 42.96,32.35 44.2,31.11 C8.2

### Text on the board
tNames: WWW.OLIMEX.COM/DEV | Rev.A | OLIMEXINO-32U4
bNames: MADE IN BULGARIA BY: